# EAGLE schematic IOTLabor_R1 (EAGLE 7.1.0)
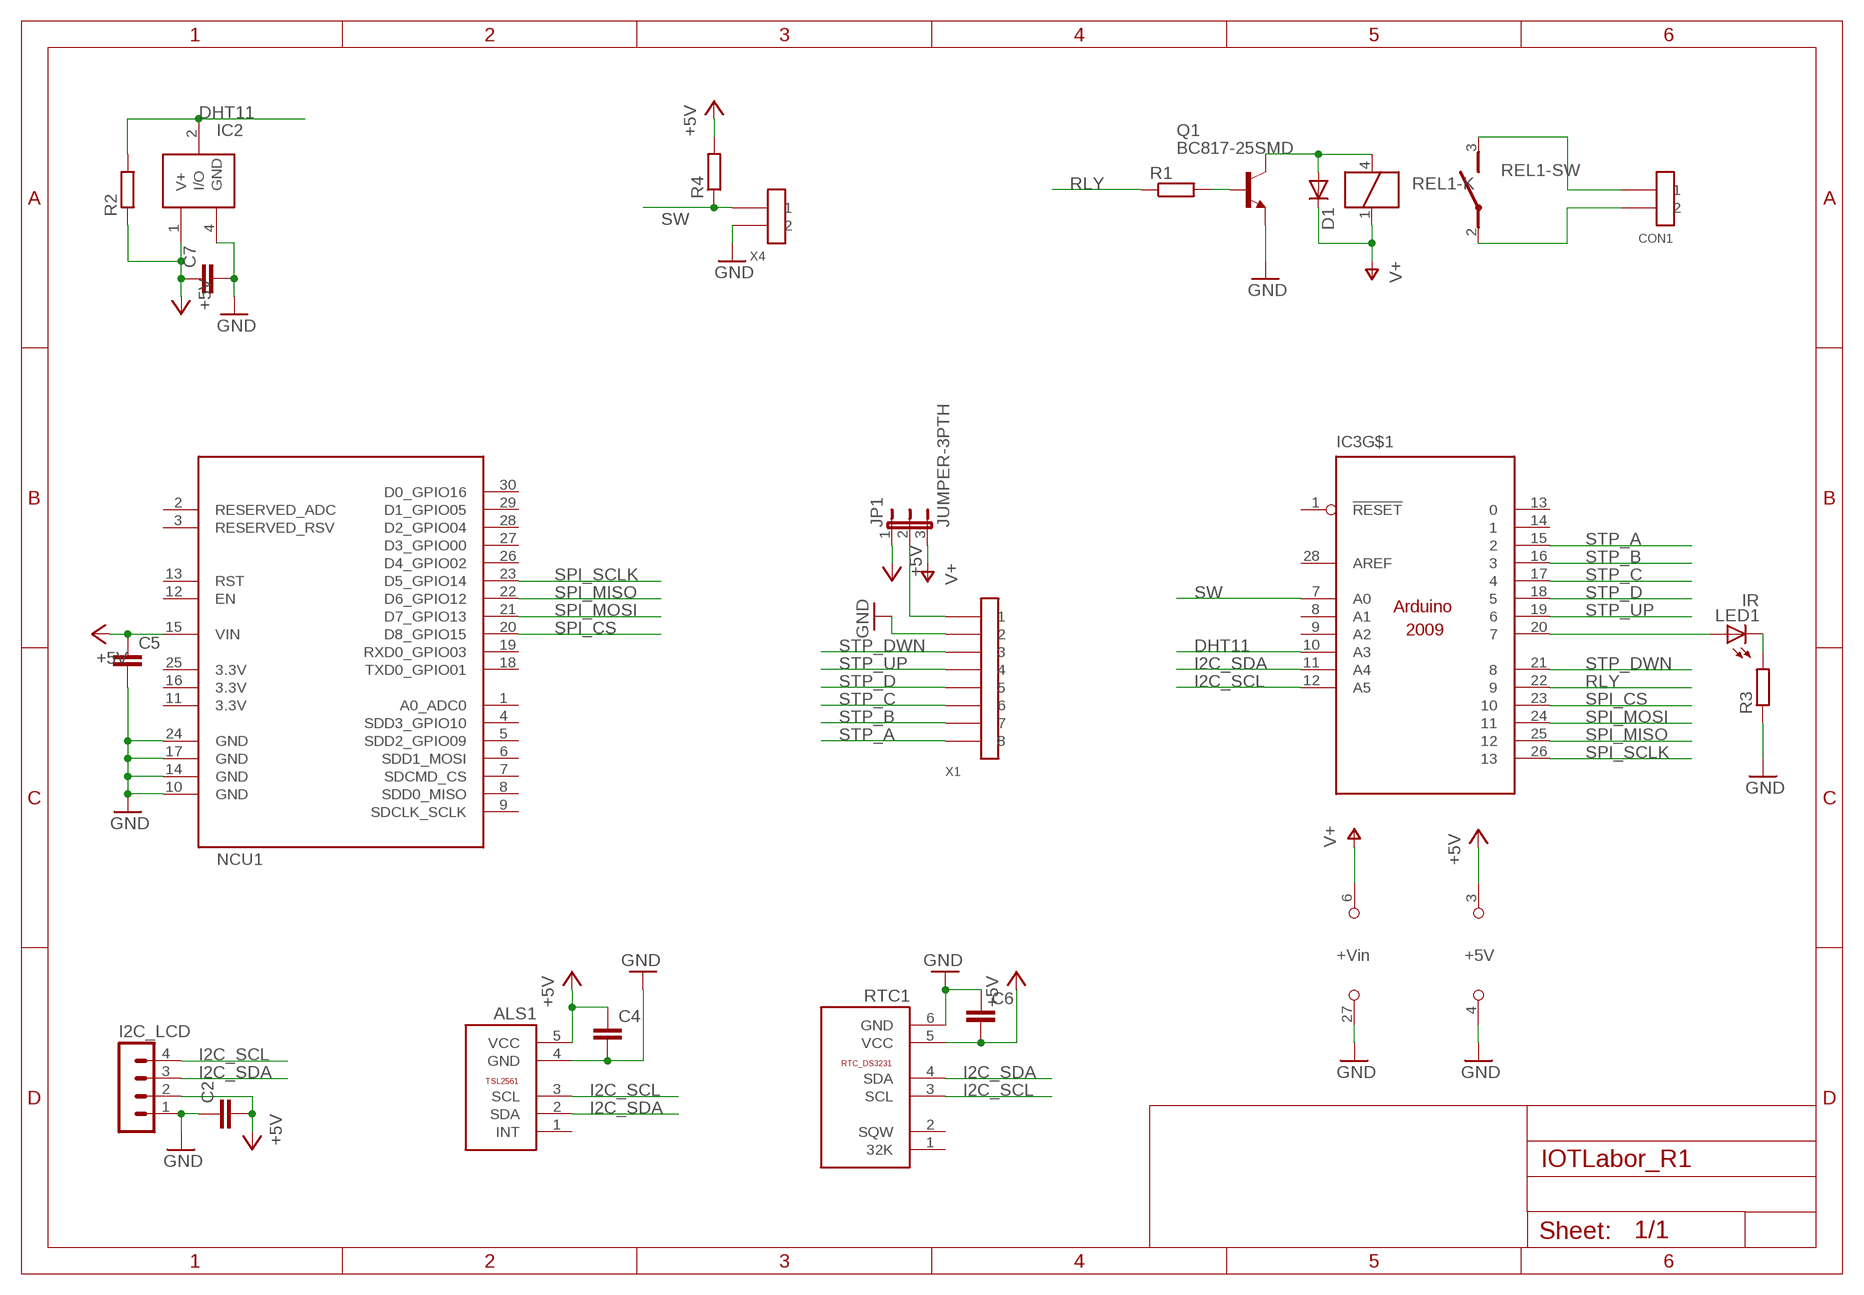
[diagram p0: schematic, sheet 1]

## Parts
ALS1  TSL2561  [TSL2561]
C2  C-EUC0805K  [C0805K]
C4  C-EUC0805K  [C0805K]
C5  C-EUC0805K  [C0805K]
C6  C-EUC0805K  [C0805K]
C7  C-EUC0805K  [C0805K]
CON1  2EDGVC-5.0-02P  [2EDGVC-5.0-02P]
D1  DIODE-MICROMELF-W  [MICROMELF-W]
I2C_LCD  MA04-1  [MA04-1]
IC2  DHT11V  [DHT11V]
IC3  ARDUINO2009_20  [ARDUINO2009]
JP1  JUMPER-3PTH  [1X03]
LED1  IR  LED3MM  [LED3MM]
NCU1  NODEMCU8266  [NODEMCU8266]
Q1  BC817-25SMD  [SOT23-BEC]
R1  R-EU_R0805  [R0805]
R2  R-EU_R0805  [R0805]
R3  R-EU_R0805  [R0805]
R4  R-EU_R0805  [R0805]
REL1  0J-SS-112  [0J-SS-112]
RTC1  RTC_DS3231  [RTC]
X1  15EDG-8PV  [15EDGVC-3.5-08P]
X4  15EDG-2PV  [15EDGVC-3.5-02P]

## Nets
+5V: ALS1.5(VCC) C2.2 C4.1 C5.1 C6.2 C7.1 I2C_LCD.2 IC2.1(V+) IC3.3(+5V) JP1.1 NCU1.15(VIN) R2.1 R4.2 RTC1.5(VCC)
DHT11: IC2.2(I/O) IC3.10(A3) R2.2
GND: ALS1.4(GND) C2.1 C4.2 C5.2 C6.1 C7.2 I2C_LCD.1 IC2.4(GND) IC3.4(GND) IC3.27(GND) NCU1.10(GND) NCU1.14(GND) NCU1.17(GND) NCU1.24(GND) Q1.E R3.1 RTC1.6(GND) X1.2 X4.2
I2C_SCL: ALS1.3(SCL) I2C_LCD.4 IC3.12(A5) RTC1.3(SCL)
I2C_SDA: ALS1.2(SDA) I2C_LCD.3 IC3.11(A4) RTC1.4(SDA)
N$1: CON1.1 REL1.3
N$2: CON1.2 REL1.2
N$3: IC3.20 LED1.A
N$4: D1.A Q1.C REL1.4
N$5: Q1.B R1.2
N$6: LED1.K(C) R3.2
N$8: JP1.2 X1.1
RLY: IC3.22 R1.1
SPI_CS: IC3.23 NCU1.20(D8_GPIO15)
SPI_MISO: IC3.25 NCU1.22(D6_GPIO12)
SPI_MOSI: IC3.24 NCU1.21(D7_GPIO13)
SPI_SCLK: IC3.26 NCU1.23(D5_GPIO14)
STP_A: IC3.15 X1.8
STP_B: IC3.16 X1.7
STP_C: IC3.17 X1.6
STP_D: IC3.18 X1.5
STP_DWN: IC3.21 X1.3
STP_UP: IC3.19 X1.4
SW: IC3.7(A0) R4.1 X4.1
V+: D1.C IC3.6(+VIN) JP1.3 REL1.1
Unconnected: ALS1.1(INT) IC3.1(!RESET) IC3.8(A1) IC3.9(A2) IC3.13 IC3.14 IC3.28(AREF) NCU1.1(A0_ADC0) NCU1.2(RESERVED_ADC) NCU1.3(RESERVED_RSV) NCU1.4(SDD3_GPIO10) NCU1.5(SDD2_GPIO09) NCU1.6(SDD1_MOSI) NCU1.7(SDCMD_CS) NCU1.8(SDD0_MISO) NCU1.9(SDCLK_SCLK) NCU1.12(EN) NCU1.13(RST) NCU1.18(TXD0_GPIO01) NCU1.19(RXD0_GPIO03) NCU1.26(D4_GPIO02) NCU1.27(D3_GPIO00) NCU1.28(D2_GPIO04) NCU1.29(D1_GPIO05) NCU1.30(D0_GPIO16) RTC1.1(32K) RTC1.2(SQW)

## Power pins joined to a net without a drawn wire
3.3V: NCU1.11(3.3V) NCU1.16(3.3V) NCU1.25(3.3V)
+3V3: IC3.2(+3V3)
GND: IC3.5(GND)

## Library data of the parts
ALS1 = IOTLabor2021:TSL2561
C2 C4-C7 = rcl:C-EU: CAPACITOR, European symbol
CON1 = util_:2EDGVC-5.0-02P: degson
D1 = diode:DIODE-: DIODE
I2C_LCD = con-lstb:MA04-1: PIN HEADER
IC2 = util_:DHT11: http://www.exp-tech.de/service/datasheet/DHT11.PDF
IC3 = IOTLabor2021:ARDUINO2009_2: The Arduino Duemilanove ("2009") is a microcontroller board based on the ATmega168 or ATmega328. - 14 digital input/output pins (of which 6 can be used as PWM outputs) - 6 analog inputs, a 16 MHz crystal oscillator - USB connection - power jack - ISP header - reset button It contains everything needed to support the microcontroller; simply connect it to a computer with a USB cable or power it with a AC-to-DC adapter or battery to get started http://arduino.cc/en/Main/ArduinoBoardDuemilanove
JP1 = SparkFun:JUMPER-3
LED1 = led:LED: LED OSRAM: - CHIPLED LG R971, LG N971, LY N971, LG Q971, LY Q971, LO R971, LY R971 LH N974, LH R974 LS Q976, LO Q976, LY Q976 LO Q996 - Hyper CHIPLED LW Q18S LB Q993, LB Q99A, LB R99A - SideLED LS A670, LO A670, LY A670, LG A670, LP A670 LB A673, LV A673, LT A673, LW A673 LH A674 LY A675 LS A676, LA A676, LO A676, LY A676, LW A676 LS A679, LY A679, LG A679 - Hyper Micro SIDELED® LS Y876, LA Y876, LO Y876, LY Y876 LT Y87S - SmartLED LW L88C, LW L88S LB L89C, LB L89S, LG L890 LS L89K, LO L89K, LY L89K LS L896, LA L896, LO L896, LY L896 - TOPLED LS T670, LO T670, LY T670, LG T670, LP T670 LSG T670, LSP T670, LSY T670, LOP T670, LYG T670 LG T671, LOG T671, LSG T671 LB T673, LV T673, LT T673, LW T673 LH T674 LS T676, LA T676, LO T676, LY T676, LB T676, LH T676, LSB T676, LW T676 LB T67C, LV T67C, LT T67C, LS T67K, LO T67K, LY T67K, LW E67C LS E67B, LA E67B, LO E67B, LY E67B, LB E67C, LV E67C, LT E67C LW T67C LS T679, LY T679, LG T679 LS T770, LO T770, LY T770, LG T770, LP T770 LB T773, LV T773, LT T773, LW T773 LH T774 LS E675, LA E675, LY E675, LS T675 LS T776, LA T776, LO T776, LY T776, LB T776 LHGB T686 LT T68C, LB T68C - Hyper Mini TOPLED® LB M676 - Mini TOPLED Santana® LG M470 LS M47K, LO M47K, LY M47K Source: http://www.osram.convergy.de LUXEON: - LUMILED® LXK2-PW12-R00, LXK2-PW12-S00, LXK2-PW14-U00, LXK2-PW14-V00 LXK2-PM12-R00, LXK2-PM12-S00, LXK2-PM14-U00 LXK2-PE12-Q00, LXK2-PE12-R00, LXK2-PE12-S00, LXK2-PE14-T00, LXK2-PE14-U00 LXK2-PB12-K00, LXK2-PB12-L00, LXK2-PB12-M00, LXK2-PB14-N00, LXK2-PB14-P00, LXK2-PB14-Q00 LXK2-PR12-L00, LXK2-PR12-M00, LXK2-PR14-Q00, LXK2-PR14-R00 LXK2-PD12-Q00, LXK2-PD12-R00, LXK2-PD12-S00 LXK2-PH12-R00, LXK2-PH12-S00 LXK2-PL12-P00, LXK2-PL12-Q00, LXK2-PL12-R00 Source: www.luxeon.com KINGBRIGHT: KA-3528ASYC Source: www.kingbright.com
NCU1 = NodeMCU:NODEMCU8266
Q1 = util_:BC817*: NPN Transistor
R1-R4 = rcl:R-EU_: RESISTOR, European symbol
REL1 = util_:0J-SS-112: http://www.te.com/catalog/pn/en/1419135-3
RTC1 = IOTLabor2021:RTC_DS3231
X1 = util_:15EDG-8P: www.degson.com
X4 = util_:15EDG-2P: www.degson.com